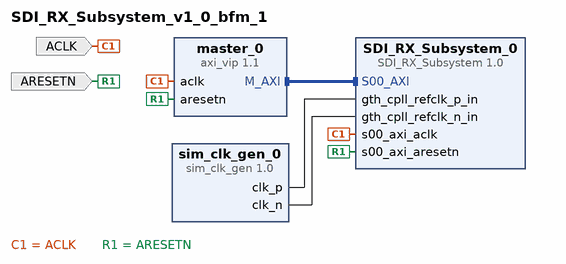
[diagram p0: block diagram of the top level]
# Vivado block design SDI_RX_Subsystem_v1_0_bfm_1, xczu9eg-ffvc900-1-i-es1, Vivado 2017.4
create_bd_design SDI_RX_Subsystem_v1_0_bfm_1

create_bd_port -dir I -type clk ACLK
set_property -dict [list \
  CONFIG.FREQ_HZ 100000000 \
  CONFIG.PHASE 0.000 \
  CONFIG.CLK_DOMAIN SDI_RX_Subsystem_v1_0_bfm_1_ACLK \
  CONFIG.ASSOCIATED_RESET ARESETN \
] [get_bd_ports ACLK]
create_bd_port -dir I -type rst ARESETN
set_property -dict {CONFIG.POLARITY ACTIVE_LOW} [get_bd_ports ARESETN]

create_bd_cell -type ip -vlnv xilinx.com:ip:axi_vip:1.1 master_0
set_property -dict [list \
  CONFIG.PROTOCOL AXI4LITE \
  CONFIG.READ_WRITE_MODE READ_WRITE \
  CONFIG.INTERFACE_MODE MASTER \
  CONFIG.ADDR_WIDTH 32 \
  CONFIG.DATA_WIDTH 32 \
  CONFIG.HAS_PROT 1 \
  CONFIG.HAS_WSTRB 1 \
  CONFIG.HAS_BRESP 1 \
  CONFIG.HAS_RRESP 1 \
] [get_bd_cells master_0]
create_bd_cell -type ip -vlnv xilinx.com:ip:sim_clk_gen:1.0 sim_clk_gen_0
set_property -dict {CONFIG.CLOCK_TYPE Differential CONFIG.FREQ_HZ 148500000} [get_bd_cells sim_clk_gen_0]
create_bd_cell -type ip -vlnv xilinx.com:user:SDI_RX_Subsystem:1.0 SDI_RX_Subsystem_0

# ---- connections ----

connect_bd_intf_net [get_bd_intf_pins master_0/M_AXI] [get_bd_intf_pins SDI_RX_Subsystem_0/S00_AXI]
connect_bd_net -net aclk_net [get_bd_ports ACLK] [get_bd_pins master_0/aclk] [get_bd_pins SDI_RX_Subsystem_0/s00_axi_aclk]
connect_bd_net -net aresetn_net [get_bd_ports ARESETN] [get_bd_pins master_0/aresetn] [get_bd_pins SDI_RX_Subsystem_0/s00_axi_aresetn]
connect_bd_net [get_bd_pins sim_clk_gen_0/clk_p] [get_bd_pins SDI_RX_Subsystem_0/gth_cpll_refclk_p_in]
connect_bd_net [get_bd_pins sim_clk_gen_0/clk_n] [get_bd_pins SDI_RX_Subsystem_0/gth_cpll_refclk_n_in]

# ---- address map ----
assign_bd_address -offset 0x44A00000 -range 64K -target_address_space [get_bd_addr_spaces master_0/Master_AXI] [get_bd_addr_segs SDI_RX_Subsystem_0/S00_AXI/S00_AXI_reg]

validate_bd_design
save_bd_design
